# EAGLE design L3GD20H (EAGLE 9.0.0)
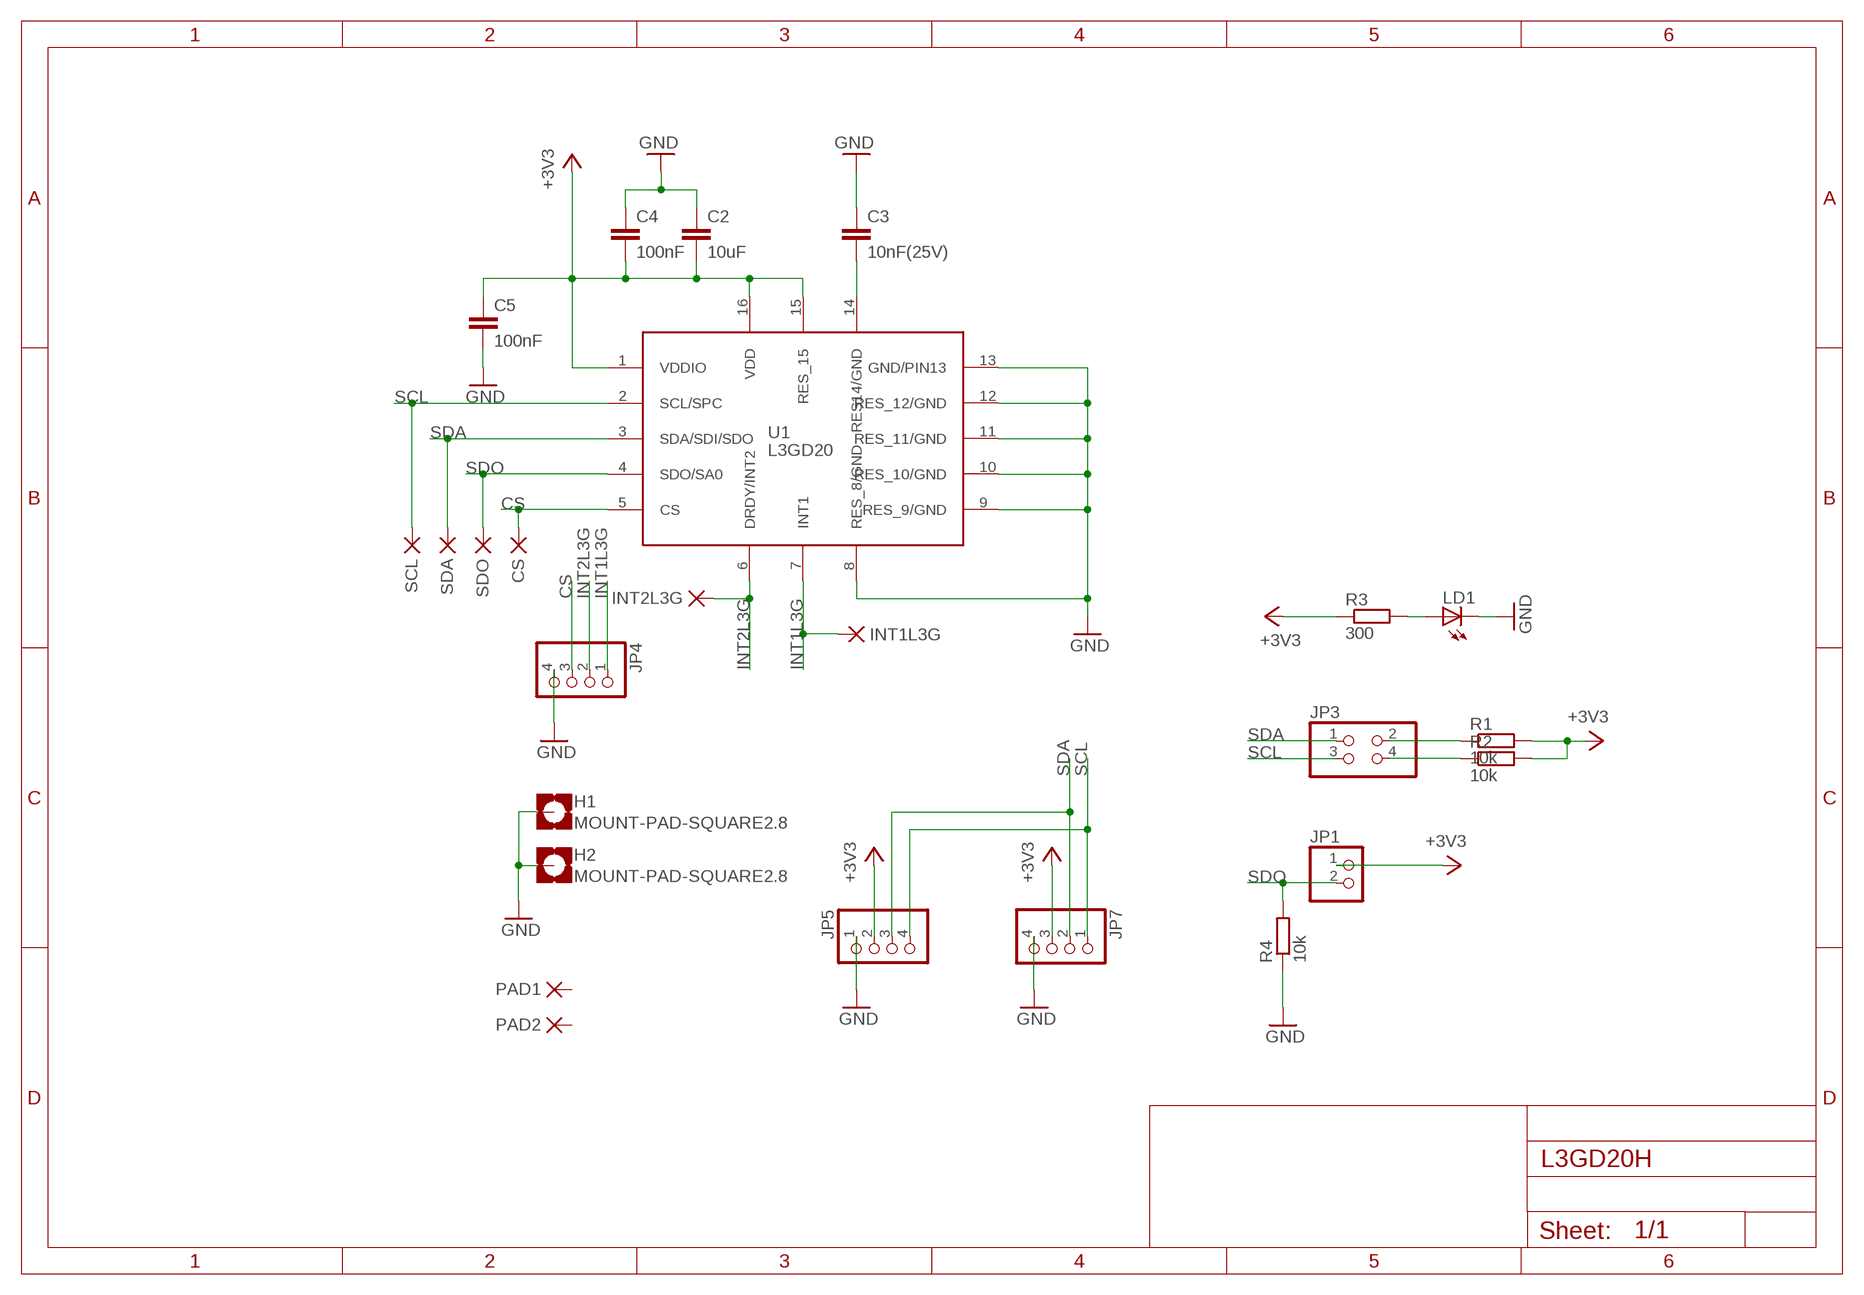
[diagram p0: schematic, sheet 1]

## Parts
C2  10uF  C-EUC0805  [C0805]
C3  10nF(25V)  C-EUC0805  [C0805]
C4  100nF  C-EUC0805  [C0805]
C5  100nF  C-EUC0805  [C0805]
CS  PAD-SMD10R  [SMD10R]
H1  MOUNT-PAD-SQUARE2.8  [2,8-PAD-SQUARE]
H2  MOUNT-PAD-SQUARE2.8  [2,8-PAD-SQUARE]
INT1L3G  PAD-SMD10R  [SMD10R]
INT2L3G  PAD-SMD10R  [SMD10R]
JP1  PINHD-1X2  [1X02]
JP3  PINHD-2X2_2.54  [2X02]
JP4  PINHD-1X4  [1X04]
JP5  PINHD-1X4_2.54-90°  [1X04/90]
JP7  PINHD-1X4_2.54-90°  [1X04/90]
LD1  LEDCHIPLED_0805  [CHIPLED_0805]
PAD1  PAD-SMD10R  [SMD10R]
PAD2  PAD-SMD10R  [SMD10R]
R1  10k  R-EU_R0805  [R0805]
R2  10k  R-EU_R0805  [R0805]
R3  300  R-EU_R0805  [R0805]
R4  10k  R-EU_R0805  [R0805]
SCL  PAD-SMD10R  [SMD10R]
SDA  PAD-SMD10R  [SMD10R]
SDO  PAD-SMD10R  [SMD10R]
U1  L3GD20  [LGA16R65P4X4_400X400X160]

## Nets
+3V3: C2.2 C4.2 C5.1 JP1.1 JP5.2 JP7.3 R1.2 R2.2 R3.1 U1.1(VDDIO) U1.15(RES_15) U1.16(VDD)
CS: CS.PAD(P) JP4.3 U1.5(CS)
GND: C2.1 C3.1 C4.1 C5.2 H1.B2,8(MOUNT) H2.B2,8(MOUNT) JP4.4 JP5.1 JP7.4 LD1.C R4.1 U1.8(RES_8/GND) U1.9(RES_9/GND) U1.10(RES_10/GND) U1.11(RES_11/GND) U1.12(RES_12/GND) U1.13(GND/PIN13)
INT1L3G: INT1L3G.PAD(P) JP4.1 U1.7(INT1)
INT2L3G: INT2L3G.PAD(P) JP4.2 U1.6(DRDY/INT2)
N$1: JP3.2 R1.1
N$2: C3.2 U1.14(RES14/GND)
N$12: JP3.4 R2.1
N$15: LD1.A R3.2
SCL: JP3.3 JP5.4 JP7.1 SCL.PAD(P) U1.2(SCL/SPC)
SDA: JP3.1 JP5.3 JP7.2 SDA.PAD(P) U1.3(SDA/SDI/SDO)
SDO: JP1.2 R4.2 SDO.PAD(P) U1.4(SDO/SA0)
Unconnected: PAD1.PAD(P) PAD2.PAD(P)

## Library data of the parts
C2-C5 = rcl:C-EU: CAPACITOR, European symbol
CS INT1L3G INT2L3G PAD1 PAD2 SCL SDA SDO = dpads:PAD: WIRE PAD Standard US Drill Sizes and SMD pads
H1 H2 = holes:MOUNT-PAD-SQUARE: MOUNTING PAD, square
JP1 = pinhead:PINHD-1X2: PIN HEADER
JP3 = pinhead-1:PINHD-2X2: PIN HEADER
JP4 = pinhead:PINHD-1X4: PIN HEADER
JP5 JP7 = pinhead-1:PINHD-1X4: PIN HEADER
LD1 = led:LED: LED OSRAM: - CHIPLED LG R971, LG N971, LY N971, LG Q971, LY Q971, LO R971, LY R971 LH N974, LH R974 LS Q976, LO Q976, LY Q976 LO Q996 - Hyper CHIPLED LW Q18S LB Q993, LB Q99A, LB R99A - SideLED LS A670, LO A670, LY A670, LG A670, LP A670 LB A673, LV A673, LT A673, LW A673 LH A674 LY A675 LS A676, LA A676, LO A676, LY A676, LW A676 LS A679, LY A679, LG A679 - Hyper Micro SIDELED® LS Y876, LA Y876, LO Y876, LY Y876 LT Y87S - SmartLED LW L88C, LW L88S LB L89C, LB L89S, LG L890 LS L89K, LO L89K, LY L89K LS L896, LA L896, LO L896, LY L896 - TOPLED LS T670, LO T670, LY T670, LG T670, LP T670 LSG T670, LSP T670, LSY T670, LOP T670, LYG T670 LG T671, LOG T671, LSG T671 LB T673, LV T673, LT T673, LW T673 LH T674 LS T676, LA T676, LO T676, LY T676, LB T676, LH T676, LSB T676, LW T676 LB T67C, LV T67C, LT T67C, LS T67K, LO T67K, LY T67K, LW E67C LS E67B, LA E67B, LO E67B, LY E67B, LB E67C, LV E67C, LT E67C LW T67C LS T679, LY T679, LG T679 LS T770, LO T770, LY T770, LG T770, LP T770 LB T773, LV T773, LT T773, LW T773 LH T774 LS E675, LA E675, LY E675, LS T675 LS T776, LA T776, LO T776, LY T776, LB T776 LHGB T686 LT T68C, LB T68C - Hyper Mini TOPLED® LB M676 - Mini TOPLED Santana® LG M470 LS M47K, LO M47K, LY M47K Source: http://www.osram.convergy.de/
R1 R2 R4 = rcl:R-EU_: RESISTOR, European symbol
R3 = resistor:R-EU_: RESISTOR, European symbol
U1 = L3GD20:L3GD20: MEMS motion sensor: three-axis digital output gyroscope

## Board
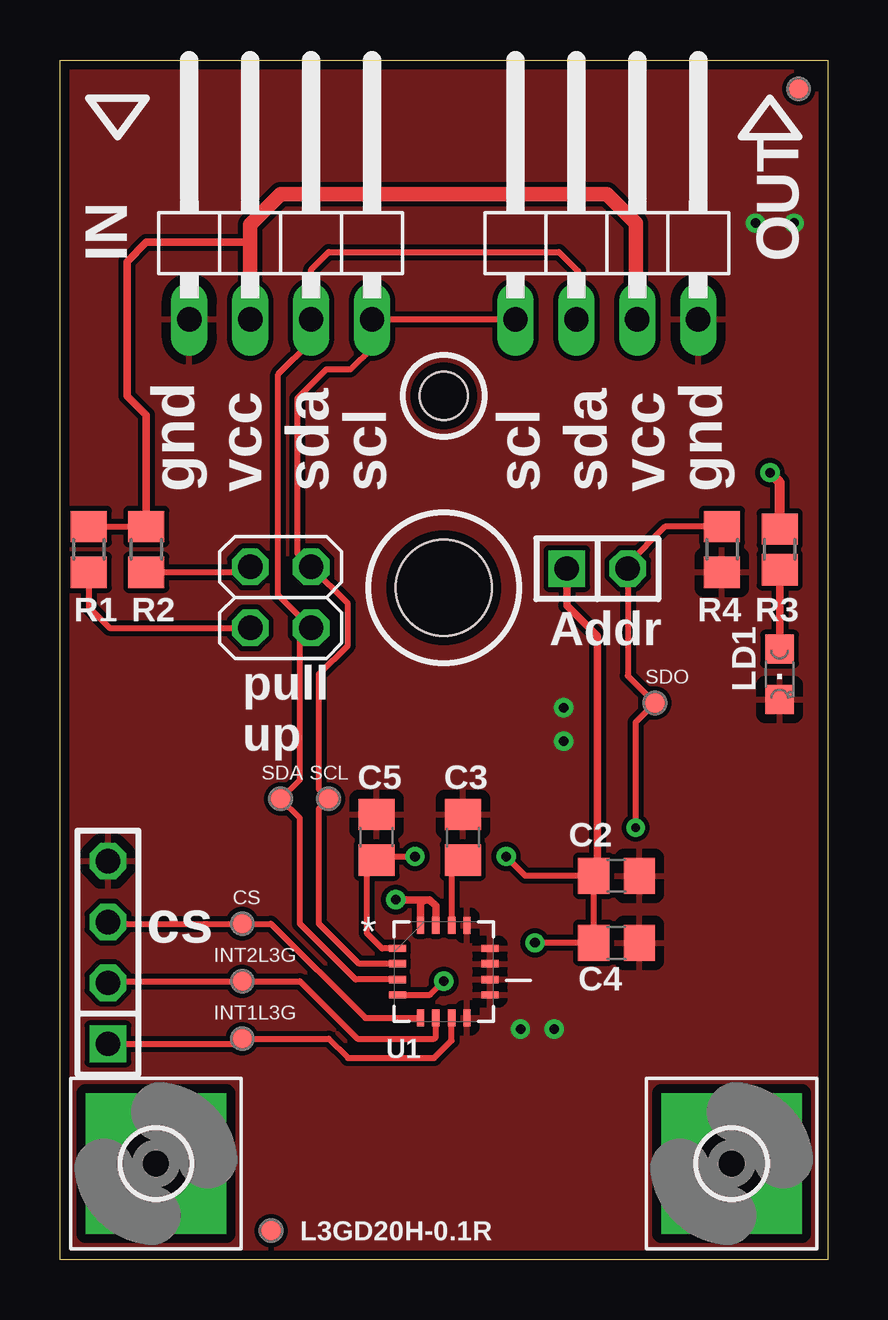
[diagram p1: board, top side]
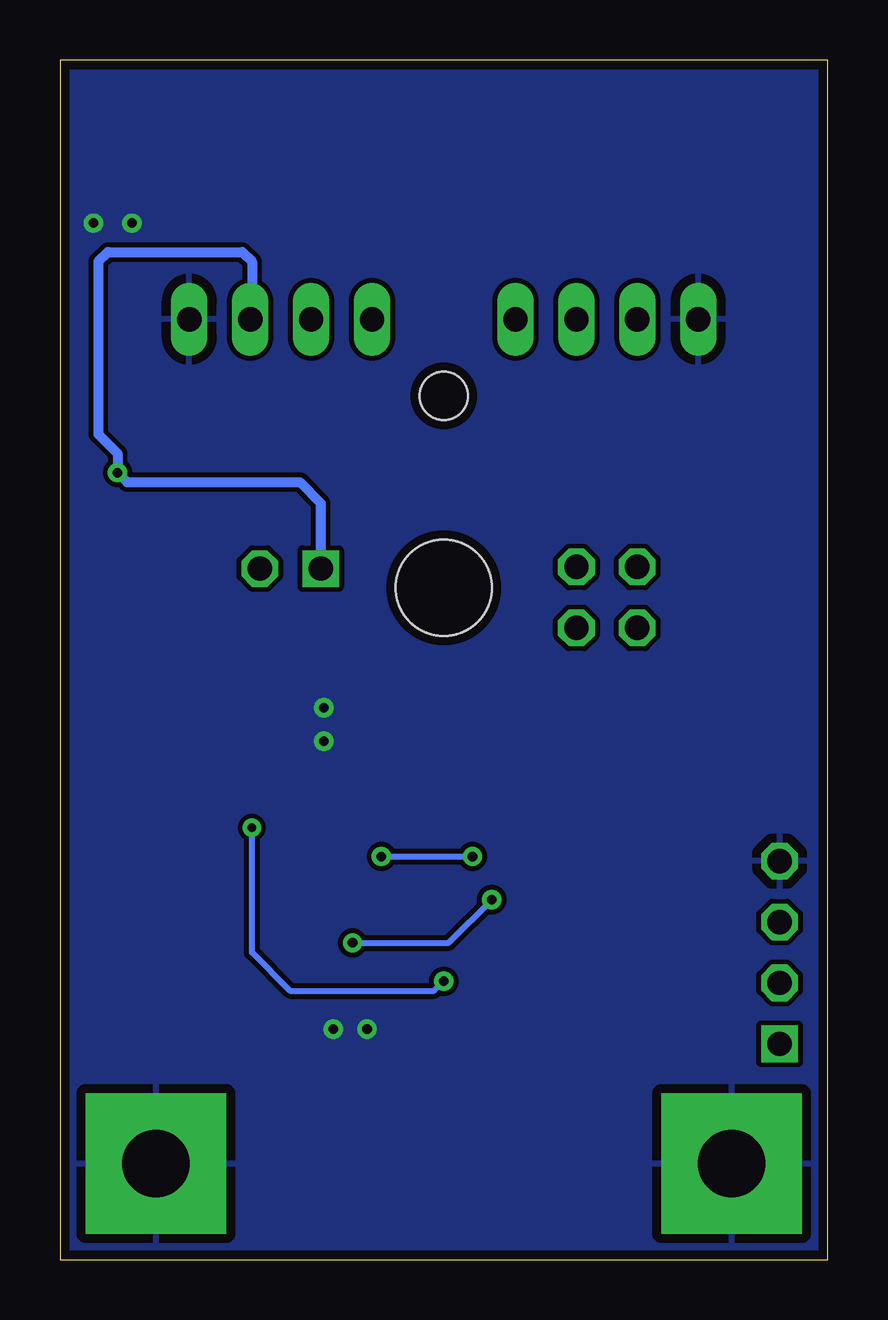
[diagram p2: board, bottom side, seen from below]

Size 32 x 50 mm. Coordinates in mm from the lower left corner, seen from the top.
Outline: 0,0 0,50 32,50 32,0 0,0
Copper layers (1*16): Top 0.035mm / dielectric 1.5mm / Bottom 0.035mm
Design rules "default *": minimum track width 10mil, minimum drill 24mil, track to track 8mil, track to pad 8mil, pad to pad 7mil, via to via 8mil, smd to smd 2mil, copper to edge 15mil, drill to drill 10mil, minimum pad ring 10mil, minimum via ring 8mil, stop-mask expansion 1mil, vias tented up to drill 0.6mm, thermal gap 15mil
Holes 2 mm at 16,36
Holes 4 mm at 16,28

### Footprints (pad centres in the part's own frame; a part is rotated, then mirrored left to right if it is on the bottom)
C0805 = smd 1.3 x 1.5: 1 -0.95,0; 2 0.95,0
SMD10R = smd 1 x 1: PAD 0,0
2,8-PAD-SQUARE = drill 2.8 pad 5.842 square: B2,8 0,0
1X02 = drill 1.016 square: 1 -1.27,0 | drill 1.016 octagon: 2 1.27,0
2X02 = drill 1.016 octagon: 1 -1.27,-1.27; 2 -1.27,1.27; 3 1.27,-1.27; 4 1.27,1.27
1X04 = drill 1.016 square: 1 -3.81,0 | drill 1.016 octagon: 2 -1.27,0; 3 1.27,0; 4 3.81,0
1X04/90 = drill 1.016 long: 1 -3.81,-3.81; 2 -1.27,-3.81; 3 1.27,-3.81; 4 3.81,-3.81
CHIPLED_0805 = smd 1.2 x 1.2: A 0,-1.05; C 0,1.05
R0805 = smd 1.3 x 1.5: 1 -0.95,0; 2 0.95,0
R0805' = smd 1.3 x 1.5: 1 -0.85,0; 2 0.85,0
LGA16R65P4X4_400X400X160 = smd 0.711 x 0.305: 1 -1.93,0.965; 2 -1.93,0.33; 3 -1.93,-0.33; 4 -1.93,-0.965; 9 1.93,-0.965; 10 1.93,-0.33; 11 1.93,0.33; 12 1.93,0.965 | smd 0.305 x 0.711: 5 -0.965,-1.93; 6 -0.33,-1.93; 7 0.33,-1.93; 8 0.965,-1.93; 13 0.965,1.93; 14 0.33,1.93; 15 -0.33,1.93; 16 -0.965,1.93

### Placement (x,y rotation side)
C2  23.2,16 180 top
C3  16.8,17.6 270 top
C4  23.2,13.2 180 top
C5  13.2,17.6 90 top
CS  7.6,14 0 top
H1  28,4 180 top
H2  4,4 180 top
INT1L3G  7.6,9.2 0 top
INT2L3G  7.6,11.6 0 top
JP1  22.4,28.8 0 top
JP3  9.2,27.6 90 top
JP4  2,12.8 90 top
JP5  9.2,43 0 top
JP7  22.8,43 0 top
LD1  30,24.4 180 top
PAD1  30.8,48.8 0 top
PAD2  8.8,1.2 0 top
R1  1.2,29.6 90 top
R2  3.6,29.6 90 top
R3  300  [R0805']  30,29.6 270 top
R4  27.6,29.6 90 top
SCL  11.2,19.2 0 top
SDA  9.2,19.2 0 top
SDO  24.8,23.2 0 top
U1  16,12 0 top

### Tracks (layer width: path | path; a pad name or v marks a point on that pad's centre or on a via)
+3V3  (via drill 0.4)
  Top 0.254: v14.8,16.8 13.25,16.8 C5.1 12.8,16.25 12.8,13.6 13.44,12.96 U1.1 | v18.6,16.8 19.4,16 C2.2 C4.2 v19.8,13.2 | R1.2 R2.2
  Top 0.305: JP1.1 21.13,27.27 22.4,26 22.4,15.91 C2.2 22.45,15.78 | R2.2 3.6,35.2 2.8,36 2.8,41.6 3.6,42.4 7.93,42.4 | U1.15 15.67,14.73 15.4,15 15.2,15 | 15.2,15 v14,15 | U1.16 15.04,14.84 15.2,15
  Top 0.406: v29.6,32.8 30,32.4 R3.1
  Top 0.61: JP5.2 7.93,42.4 7.93,43.13 9.2,44.4 22.8,44.4 24,43.2 24,39.26 JP7.3
  Bottom 0.254: v18.6,16.8 v14.8,16.8 | v19.8,13.2 15.8,13.2 v14,15
  Bottom 0.406: JP7.3 24,39.26 24,41.6 24.4,42 30,42 30.4,41.6 30.4,34.4 29.6,33.6 v29.6,32.8 29.2,32.4 22,32.4 21.13,31.53 JP1.1
CS
  Top 0.254: JP4.3 2.07,14 CS.PAD 8.8,14 12.73,10.07 U1.5
GND  (via drill 0.4)
  other vias: 21,23 21,21.6 29,43.2 30.6,43.2 19.2,9.6 20.6,9.6
  pour Top: -0.1,50 32.1,50.1 32.1,-0.2 -0.1,0.1
  pour Bottom: 32,0 32,50 0,50 0,0
INT1L3G
  Top 0.254: JP4.1 7.39,8.99 INT1L3G.PAD 11.2,9.2 12,8.4 15.6,8.4 16.33,9.13 U1.7
INT2L3G
  Top 0.254: JP4.2 2.07,11.6 INT2L3G.PAD 10,11.6 12.4,9.2 15.6,9.2 15.67,9.27 U1.6
N$1
  Top 0.254: R1.1 1.2,27.2 2.07,26.33 JP3.2
N$2
  Top 0.254: 16.51,16.8 C3.2 16.33,16.18 U1.14
N$12
  Top 0.254: R2.1 7.71,28.65 JP3.4
N$15
  Top 0.305: R3.2 LD1.A
SCL
  Top 0.254: JP7.1 JP5.4 13,38 12.1,37.1 11.1,37.1 9.9,35.9 9.9,29.44 JP3.3 12,27.34 12,25.6 10.8,24.4 10.8,19.6 SCL.PAD 10.8,18.8 10.8,14 12.47,12.33 U1.2
SDA
  Top 0.254: 10.47,38.67 JP5.3 10.47,41.27 11.2,42 20.8,42 21.6,41.2 21.6,39.26 | 10.47,38.27 9.1,36.9 9.1,27.7 JP3.1 10,25.86 10,20 SDA.PAD 10,18.4 10,14 12.33,11.67 U1.3
  Top 0.305: 10.47,38.67 10.47,38.27
  Top 0.406: 21.6,39.26 JP7.2
SDO  (via drill 0.35, 0.4)
  Top 0.254: U1.4 15.44,11.04 v16,11.6 | R4.2 25.22,30.55 23.67,29 JP1.2 23.67,24.33 SDO.PAD 24,22.4 v24,18
  Bottom 0.254: v24,18 24,12.8 22.4,11.2 16.4,11.2 v16,11.6

### Text on the board
tNames: IN | OUT | gnd | vcc | sda | scl | scl | sda | vcc | gnd | Addr | pull / up | cs | L3GD20H-0.1R